# EasyEDA Pro project ProDoc_PCB2_2026-01-19.epro

# Board PCB2
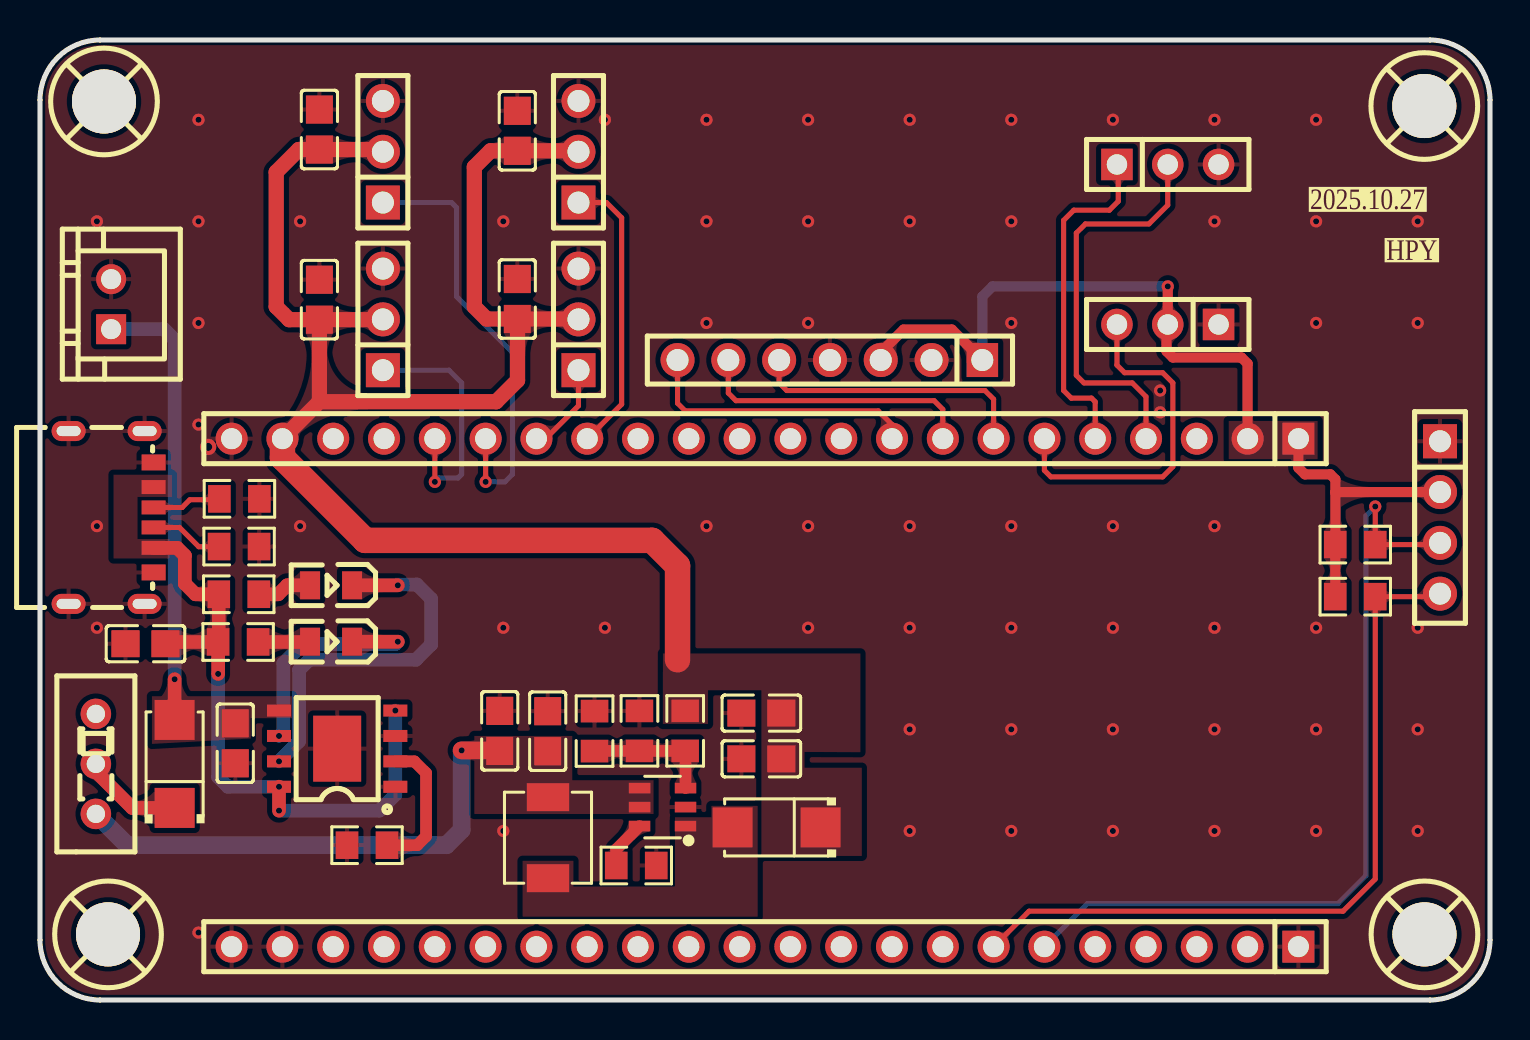
[diagram p0: board, top side]
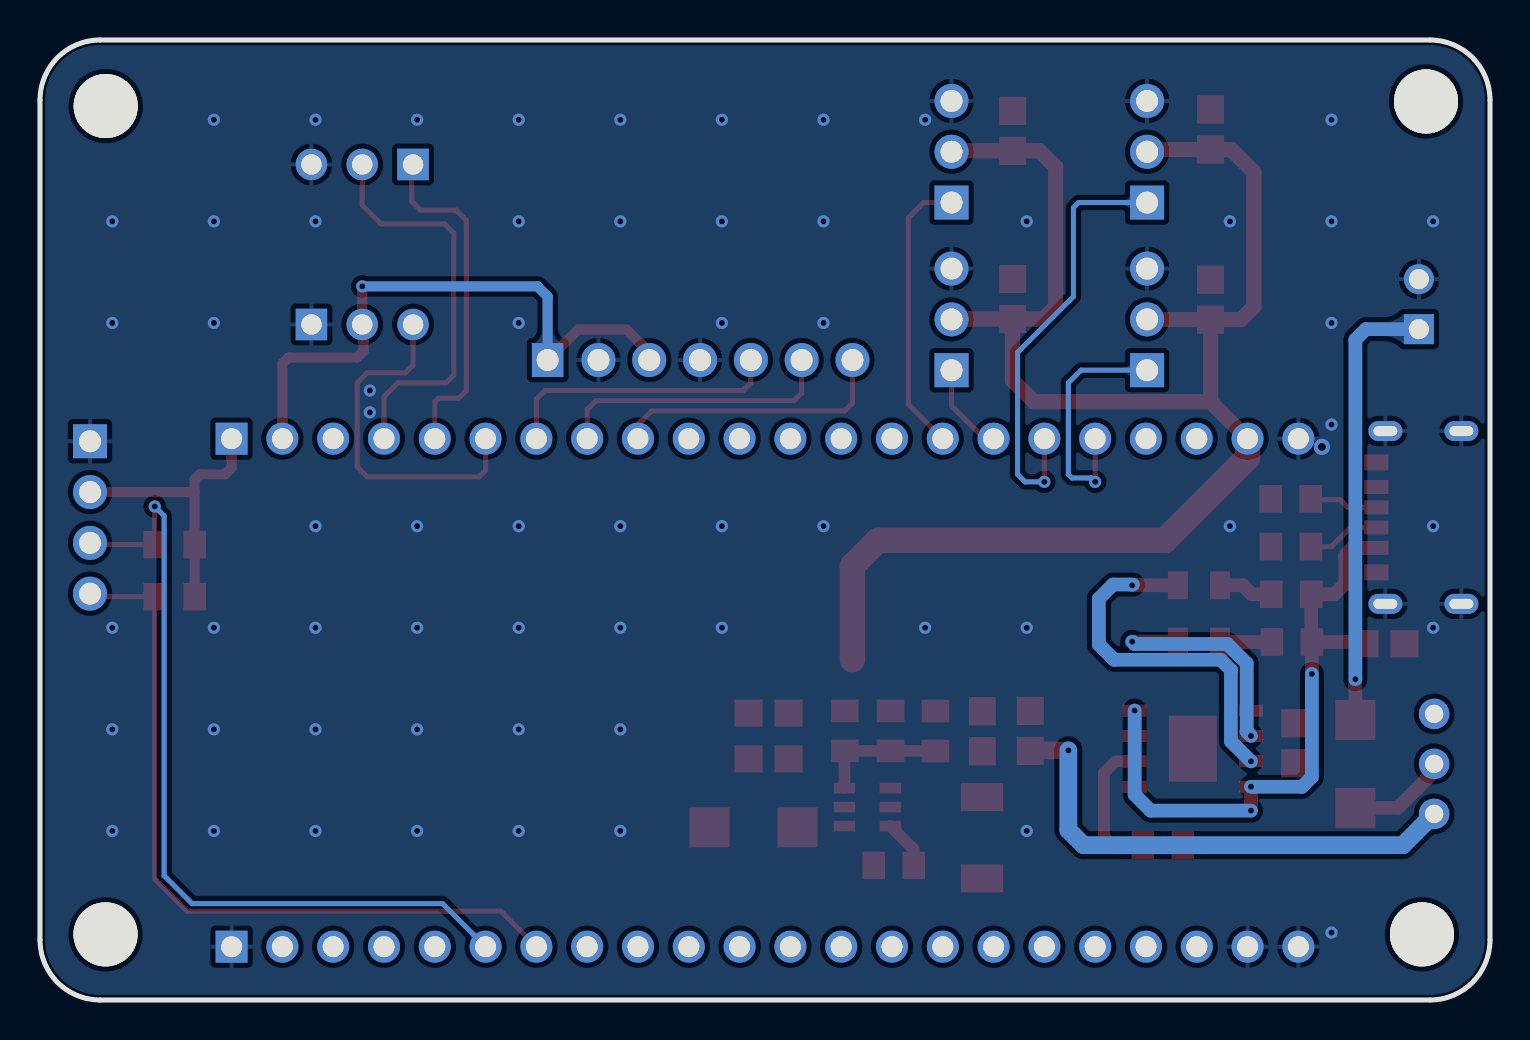
[diagram p1: board, bottom side, seen from below]

Outline 72.5 x 48 mm; copper layers: Top Layer, Bottom Layer. Coordinates in mm from the lower left corner of the outline.
Outline path: 0,45 0,3 arc(0.88,0.88) 3,0 69.5,0 arc(71.62,0.88) 72.5,3 72.5,45 arc(71.62,47.12) 69.5,48 3,48 arc(0.88,47.12) 0,45
Stack: Top Layer 0.035mm / Dielectric1 1.51mm FR4 er 4.5 / Bottom Layer 0.035mm

## Design rules (mm)
template: JLCPCB Capability(Two Layers Board)
spacing copperThickness1oz (default): track to track 0.102, other pairs 0.152 to 0.3
spacing copperThickness2oz: track to track 0.203, other pairs 0.152 to 0.3
track width copperThickness1oz (default): min 0.127, default 0.254, max 2.54
track width copperThickness2oz: min 0.203, default 0.254, max 2.54
differential pair differentialPair (default): width min 0.127, default 0.254, max 2.54; gap min 0.152, default 0.152
via viaSize (default): diameter min 0.5, default 0.61, max 10; hole min 0.3, default 0.305, max 6.3

## Placement (name value [footprint] x y rotation side)
C12  100nF  [C0805]  36.07 12.06 180 top
C14  10uF  [C0805]  9.76 12.84 90 top
C17  100nF  [C0805]  25.38 13.44 270 top
C21  10uF  [C0805]  5.28 17.81 0 top
C27  22uF  [C0805]  36.07 14.35 0 top
C28  22uF  [C0805]  22.99 13.46 270 top
C29  22uF  [C0805]  13.97 35.02 270 top
C30  22uF  [C0805]  13.97 43.52 270 top
C31  22uF  [C0805]  23.87 35.05 270 top
C32  22uF  [C0805]  23.87 43.46 270 top
CN1  HX-XH2.54-2PZZ  [CONN-TH_2P-P2.50_HX-2.54MM-2P-ZZ-MS]  3.56 34.79 90 top
D1  SS34  [SMA_L4.3-W2.6-LS5.2-RD]  36.83 8.63 180 top
D2  SS34  [SMA_L4.3-W2.6-LS5.2-RD]  6.73 11.81 90 top
H1  PZ254V-11-03P  [HDR-TH_3P-P2.54-V-M]  26.92 42.41 90 top
H2  PZ254V-11-03P  [HDR-TH_3P-P2.54-V-M]  26.92 34.03 90 top
H3  PZ254V-11-03P  [HDR-TH_3P-P2.54-V-M]  17.14 42.41 90 top
H4  PZ254V-11-03P  [HDR-TH_3P-P2.54-V-M]  17.14 34.03 90 top
L1  4.7uH  [IND-SMD_L4.4-W4.2]  25.4 8.11 270 top
LED3  NCD0805G1  [LED0805-R-RD]  14.55 17.92 180 top
LED4  NCD0805R1  [LED0805-R-RD]  14.55 20.73 180 top
R12  100kΩ  [R0805]  32.26 13.46 270 top
R13  15kΩ  [R0805]  29.97 13.46 90 top
R14  150kΩ  [R0805]  27.73 13.45 90 top
R15  24kΩ  [R0805]  29.81 6.73 0 top
R16  4.7kΩ  [R0805]  65.76 20.17 180 top
R17  5.1kΩ  [R0805]  9.97 25.06 0 top
R18  1.2kΩ  [R0805]  16.35 7.74 0 top
R20  4.7kΩ  [R0805]  65.76 22.77 180 top
R21  5.1kΩ  [R0805]  9.95 22.67 0 top
R24  1kΩ  [R0805]  9.91 17.9 0 top
R25  1kΩ  [R0805]  9.94 20.29 0 top
SCREW1  -  [M3螺丝]  69.22 44.7 0 top
SCREW2  -  [M3螺丝]  3.2 44.93 0 top
SCREW3  -  [M3螺丝]  3.4 3.28 0 top
SCREW4  -  [M3螺丝]  69.22 3.28 0 top
SW1  SS-12D01-G3  [SW-TH_SS-12D01-GX]  2.79 11.81 270 top
U9  MT3608L  [SOT-23-6_L2.9-W1.6-P0.95-LS2.8-BL_3]  31.13 9.65 90 top
U11  TP4056  [ESOP-8_L4.9-W3.9-P1.27-LS6.0-BL-EP]  14.86 12.57 90 top
U12  ZX-PM2.54-1-22PY  [HDR-TH_22P-P2.54-V-F]  36.25 28.07 180 top
U13  ZX-PM2.54-1-22PY  [HDR-TH_22P-P2.54-V-F]  36.25 2.67 180 top
U14  ZX-PM2.54-1-7PY  [HDR-TH_7P-P2.54-V-F]  39.5 32 180 top
U15  ZX-PM2.54-1-3PY  [HDR-TH_3P-P2.54-V-F]  56.39 41.78 0 top
U16  ZX-PM2.54-1-3PY  [HDR-TH_3P-P2.54-V-F]  56.39 33.78 180 top
U17  ZX-PM2.54-1-4PY  [HDR-TH_4P-P2.54-V-F]  70 24.13 270 top
USB2  TYPE-C 6P(073)  [TYPE-C-SMD_TYPE-C-6P-073]  3.56 24.13 270 top

## Footprints (pads in the part's own frame, mm; a bottom-side part is the same pattern mirrored in y, then rotated)
C0805
  rect 1.41x1.35 smd: 1(-1,0) 2(1,0)
CONN-TH_2P-P2.50_HX-2.54MM-2P-ZZ-MS
  rect 1.5x1.5 hole 1: 1(-1.25,0)
  round 1.5 hole 1: 2(1.25,0)
ESOP-8_L4.9-W3.9-P1.27-LS6.0-BL-EP
  rect 0.6x1.2 smd: 1(-1.905,-2.909) 2(-0.635,-2.909) 3(0.635,-2.909) 4(1.905,-2.909) 5(1.905,2.909) 6(0.635,2.909) 7(-0.635,2.909) 8(-1.905,2.909)
  rect 3.3x2.4 smd: 9(0,0)
HDR-TH_3P-P2.54-V-F
  rect 1.575x1.575 hole 1.02: 1(-2.54,0)
  round 1.575 hole 1.02: 2(0,0) 3(2.54,0)
HDR-TH_3P-P2.54-V-M
  rect 1.7x1.7 hole 1.1: 1(-2.54,0)
  round 1.7 hole 1.1: 2(0,0) 3(2.54,0)
HDR-TH_4P-P2.54-V-F
  rect 1.7x1.7 hole 1.1: 1(-3.81,0)
  round 1.7 hole 1.1: 2(-1.27,0) 3(1.27,0) 4(3.81,0)
HDR-TH_7P-P2.54-V-F
  rect 1.575x1.7 hole 1.1: 1(-7.62,0)
  round 1.7 hole 1.1: 2(-5.08,0) 3(-2.54,0) 4(0,0) 5(2.54,0) 6(5.08,0) 7(7.62,0)
HDR-TH_22P-P2.54-V-F
  rect 1.6x1.6 hole 1.05: 1(-26.67,0)
  round 1.6 hole 1.05: 2(-24.13,0) 3(-21.59,0) 4(-19.05,0) 5(-16.51,0) 6(-13.97,0) 7(-11.43,0) 8(-8.89,0) 9(-6.35,0) 10(-3.81,0) 11(-1.27,0) 12(1.27,0) 13(3.81,0) 14(6.35,0) 15(8.89,0) 16(11.43,0) 17(13.97,0) 18(16.51,0) 19(19.05,0) 20(21.59,0) 21(24.13,0) 22(26.67,0)
IND-SMD_L4.4-W4.2
  rect 1.4x2.12 smd: 1(2.028,0) 2(-2.028,0)
LED0805-R-RD
  rect 1x1.399 smd: 1(1.05,0) 2(-1.05,0)
M3螺丝
  round 3.2 hole 3.2: 1(0,0)
R0805
  rect 1.133x1.377 smd: 1(-1,0) 2(1,0)
SMA_L4.3-W2.6-LS5.2-RD
  rect 2x2 smd: 1(-2.2,0) 2(2.2,0)
SOT-23-6_L2.9-W1.6-P0.95-LS2.8-BL_3
  rect 0.532x1.072 smd: 1(-0.95,-1.149) 2(0,-1.149) 3(0.95,-1.149) 4(0.95,1.149) 5(0,1.149) 6(-0.95,1.149)
SW-TH_SS-12D01-GX
  round 1.524 hole 0.914: 1(-2.5,0) 2(0,0) 3(2.5,0)
TYPE-C-SMD_TYPE-C-6P-073
  oval 1x1.7 hole 0.5x1.2: 7(-4.32,1.675) 7(-4.32,-2.125) 7(4.32,1.675) 7(4.32,-2.125)
  rect 0.7x1.2 smd: A5(-0.5,2.125) A9(1.52,2.125) B5(0.5,2.125) B9(-1.52,2.125)
  rect 0.8x1.2 smd: A12(2.75,2.125) B12(-2.75,2.125)

## Nets
3V3: R16.2 R20.2 U12.1 U12.2 U14.1 U14.3 U16.2 U17.2
5V: C12.1 C27.2 C29.2 C30.2 C31.2 C32.2 D1.1 H1.2 H2.2 H3.2 H4.2 R12.1 U12.21
GND: C12.2 C14.1 C17.1 C21.1 C27.1 C28.1 C29.1 C30.1 C31.1 C32.1 CN1.2 H1.3 H2.3 H3.3 H4.3 R13.2 R14.2 R15.2 R17.2 R18.1 R21.2 U9.2 U11.1 U11.3 U11.9 U12.22 U13.1 U13.21 U13.22 U14.2 U14.4 U15.3 U16.1 U17.1 USB2.7 USB2.A12 USB2.B12
VBAT_SW: C17.2 C28.2 L1.2 SW1.3 U9.4 U9.5
BAT+: D2.1 SW1.2
INMP_SCK: U12.5 U15.1
INMP_SD: U12.6 U16.3
INMP_WS: U12.4 U15.2
MAX_BCLK: U12.8 U14.6
MAX_DIN: U12.7 U14.5
MAX_LRC: U12.9 U14.7
OLED_SCL: R20.1 U13.6 U17.3
OLED_SDA: R16.1 U13.7 U17.4
SERVO1_SIG: H1.1 U12.15
SERVO2_SIG: H2.1 U12.16
SERVO3_SIG: H3.1 U12.17
SERVO4_SIG: H4.1 U12.18
USB_5V: C21.2 R24.1 R25.1 U11.4 U11.8 USB2.A9 USB2.B9
$1N2329: R15.1 U9.6
$1N2331: D1.2 L1.1 U9.1
$1N2332: R12.2 R13.1 R14.1 U9.3
$1N2334: R18.2 U11.2
$1N2342: R17.1 USB2.A5
$1N2343: R21.1 USB2.B5
$1N2345: LED4.2 U11.7
$1N2346: LED3.1 R24.2
$1N2347: LED4.1 R25.2
$1N2350: LED3.2 U11.6
$1N2356: C14.2 CN1.1 D2.2 U11.5

Pads without a net: SCREW1 1; SCREW2 1; SCREW3 1; SCREW4 1; SW1 1; U12 3 10 11 12 13 14 19 20; U13 2 3 4 5 8 9 10 11 12 13 14 15 16 17 18 19 20

## Via types
v1: diameter 0.61, hole 0.305, Top Layer to Bottom Layer, 75 vias
v2: diameter 0.813, hole 0.406, Top Layer to Bottom Layer, 1 via

## Routing (per net, layer and track width the routed paths; a pad name or vN(x,y) marks a point on that pad's centre or on a via; arc(x,y) is an arc through that point)
3V3: length 45.2
  Top Layer w0.508: U17.2 64.78,25.4 64.77,25.39 ; 62.92,28.07 62.92,26.61 63.25,26.28 64.52,26.28 64.77,26.03 64.77,25.39 ; 64.77,25.39 64.77,22.78 R20.2 R16.2 ; 47.12,32 45.59,33.52 43.18,33.52 42.04,32.38 U14.3 ; v1(56.39,35.68) U16.2 56.32,33.71 56.32,32.44 56.64,32.13 60.07,32.13 60.38,31.82 60.38,28.07
  Bottom Layer w0.508: 47.12,32 47.12,35.17 47.62,35.68 v1(56.39,35.68)
5V: length 84
  Top Layer w0.762: H2.2 26.9,34.05 C31.2 ; U12.21 13.97,29.91 ; 13.97,29.91 C29.2 ; 13.97,29.91 22.81,29.91 23.88,30.98 23.88,34.04 C31.2 ; H3.2 17.03,42.52 C30.2 12.94,42.52 11.81,41.4 11.81,34.67 12.46,34.02 C29.2 ; C29.2 17.13,34.02 H4.2 ; C31.2 22.33,34.05 21.72,34.67 21.72,41.65 22.53,42.46 C32.2 26.88,42.46 H1.2
  Top Layer w1.27: U12.21 12.12,27.12 16.26,22.98 30.61,22.98 31.88,21.71 31.88,17.01
GND:
  vias: v1(2.84,38.93) v1(2.84,23.69) v1(2.84,18.61) v1(7.92,44.01) v1(7.92,38.93) v1(7.92,33.85) v1(7.92,28.77) v1(7.92,3.37) v1(13,38.93) v1(13,23.69) v1(23.16,38.93) v1(23.16,18.61) v1(23.16,8.45) v1(28.25,44.01) v1(28.25,18.61) v1(33.32,44.01) v1(33.32,38.93) v1(33.32,33.85) v1(33.32,23.69) v1(38.41,44.01) v1(38.41,38.93) v1(38.41,33.85) v1(38.41,23.69) v1(38.41,18.61) v1(43.49,44.01) v1(43.49,38.93) v1(43.49,23.69) v1(43.49,18.61) v1(43.49,13.53) v1(43.49,8.45) v1(48.56,44.01) v1(48.56,38.93) v1(48.56,33.85) v1(48.56,23.69) v1(48.56,18.61) v1(48.56,13.53) v1(48.56,8.45) v1(53.65,44.01) v1(53.65,23.69) v1(53.65,18.61) v1(53.65,13.53) v1(53.65,8.45) v1(56.01,30.47) v1(56.01,29.38) v1(58.72,44.01) v1(58.72,38.93) v1(58.72,23.69) v1(58.72,18.61) v1(58.72,13.53) v1(58.72,8.45) v1(63.81,44.01) v1(63.81,38.93) v1(63.81,33.85) v1(63.81,18.61) v1(63.81,13.53) v1(63.81,8.45) v1(68.88,38.93) v1(68.88,33.85) v1(68.88,18.61) v1(68.88,13.53) v1(68.88,8.45) v2(8.41,27.65)
VBAT_SW: length 25.1
  Top Layer w0.889: v1(21.08,12.48) 22.96,12.48 C28.2
  Bottom Layer w0.889: v1(21.08,12.48) 21.08,8.5 20.32,7.74 4.36,7.74 SW1.3
BAT+: length 5.1
  Top Layer w0.686: SW1.2 2.79,11.42 4.61,9.61 D2.1
INMP_SCK: length 17.2
  Top Layer w0.254: 52.76,28.07 52.76,29.91 52.58,30.09 51.56,30.09 51.18,30.47 51.18,38.98 51.69,39.49 53.47,39.49 53.91,39.94 53.91,41.59 53.85,41.65 U15.1
INMP_SD: length 17.7
  Top Layer w0.254: 50.22,28.07 50.22,26.48 50.55,26.16 56.13,26.16 56.64,26.66 56.64,30.86 56.13,31.36 54.23,31.36 53.85,31.74 U16.3
INMP_WS: length 20.3
  Top Layer w0.254: 55.3,28.07 55.3,30.17 54.61,30.86 52.2,30.86 51.82,31.24 51.82,38.35 52.27,38.8 55.45,38.8 56.39,39.75 U15.2
MAX_BCLK: length 14.2
  Top Layer w0.254: U14.6 34.42,30.35 34.8,29.97 44.7,29.97 45.14,29.53 45.14,28.07
MAX_DIN: length 14.2
  Top Layer w0.254: 47.68,28.07 47.68,30.04 47.24,30.47 37.34,30.47 36.96,30.86 36.96,32
MAX_LRC: length 14
  Top Layer w0.254: 42.6,28.07 42.6,28.77 41.91,29.46 32.26,29.46 31.88,29.84 U14.7
OLED_SCL: length 41.4
  Top Layer w0.254: v1(66.76,24.68) R20.1 69.91,22.77 U17.3
  Bottom Layer w0.254: v1(66.76,24.68) 66.29,24.21 66.29,6.22 64.9,4.82 52.37,4.82 U13.6
OLED_SDA: length 37.9
  Top Layer w0.254: U17.4 69.85,20.17 R16.1 66.76,6.05 65.15,4.44 49.45,4.44 U13.7
SERVO1_SIG: length 14.2
  Top Layer w0.254: H1.1 28.32,39.87 29.08,39.11 29.08,29.79 U12.15
SERVO2_SIG: length 4.6
  Top Layer w0.254: U12.16 25.28,28.07 26.92,29.71 H2.1
SERVO3_SIG: length 21.9
  Top Layer w0.254: U12.17 v1(22.28,25.91)
  Bottom Layer w0.254: v1(22.28,25.91) 23.25,25.91 23.62,26.28 23.62,32.38 20.83,35.17 20.83,39.62 20.57,39.87 H3.1
SERVO4_SIG: length 12.4
  Top Layer w0.254: U12.18 v1(19.74,25.91)
  Bottom Layer w0.254: H4.1 20.45,31.49 21.08,30.86 21.08,26.28 20.9,26.1 19.94,26.1 v1(19.74,25.91)
USB_5V: length 31.6
  Top Layer w0.686: R24.1 8.94,17.93 R25.1 7.77,20.29 7.24,20.82 7.24,22.22 6.86,22.61 USB2.A9 ; R24.1 v1(8.91,16.3) ; R24.1 6.36,17.9 C21.2 ; v1(11.95,10.66) v1(11.95,9.47)
  Bottom Layer w0.686: v1(11.95,9.47) 16.97,9.47 17.77,10.27 v1(17.77,14.47) ; v1(8.91,16.3) 8.91,11.15 9.4,10.66 v1(11.95,10.66)
$1N2329: length 2.5
  Top Layer w0.584: R15.1 28.81,7.53 U9.6
$1N2332: length 6.4
  Top Layer w0.584: R14.1 27.74,12.46 R13.1 R12.2 32.28,12.44 32.28,10.6
$1N2334: length 7.1
  Top Layer w0.584: R18.2 18.86,7.74 19.3,8.19 19.3,11.35 18.72,11.93 U11.2
$1N2342: length 3.5
  Top Layer w0.254: R17.1 8.92,25.01 7.49,25.01 7.11,24.63 USB2.A5
$1N2343: length 3.7
  Top Layer w0.254: USB2.B5 6.97,23.63 7.94,22.66 8.94,22.66 R21.1
$1N2345: length 18.7
  Top Layer w0.686: LED4.2 v1(17.89,20.73)
  Bottom Layer w0.686: 17.85,20.77 18.85,20.77 19.56,20.06 19.56,17.77 18.8,17.01 13.46,17.01 12.95,16.5 12.95,12.94 v1(11.95,11.93)
$1N2346: length 2.6
  Top Layer w0.686: LED3.1 13.49,17.9 R24.2
$1N2347: length 2.8
  Top Layer w0.686: LED4.1 12.36,20.73 11.91,20.29 R25.2
$1N2350: length 12.2
  Top Layer w0.686: LED3.2 v1(17.89,17.92)
  Bottom Layer w0.686: v1(17.89,17.92) 17.78,17.8 13.14,17.8 12.17,16.83 12.17,13.42 v1(11.95,13.2)
$1N2356: length 22.4
  Top Layer w0.686: D2.2 v1(6.73,16.04)
  Bottom Layer w0.686: CN1.1 6.2,33.54 6.73,33.01 v1(6.73,16.04)

## Copper pours and planes (outline as drawn; the poured copper is in the pictures)
3V3 on Top Layer: 59.44,28.95 63.88,28.95 63.88,27.05 59.44,27.05
5V on Top Layer: 31.14,17.33 41.09,17.33 41.09,7.2 31.14,7.2
GND on Top Layer: -2.67,49.52 75.31,49.52 75.31,-3.18 -2.67,-3.18
GND on Bottom Layer: -2.67,50.03 73.15,50.03 73.15,-2.04 -2.67,-2.04
VBAT_SW on Top Layer: 21.72,13.2 30.68,13.2 30.68,9.3 21.72,9.3
USB_5V on Top Layer: 3.68,26.26 6.59,26.26 6.59,22.08 3.68,22.08
$1N2331 on Top Layer: 24.13,9.71 35.88,9.71 35.88,4.17 24.13,4.17
$1N2356 on Top Layer: 5.6,15.19 12.61,15.19 12.61,12.8 5.6,12.8

Small or netless copper shapes (teardrops, artwork), in the pictures only: 84 on Top Layer, 10 on Bottom Layer

## Text on the board
Top Silkscreen Layer: 2025.10.27 | HPY
